# Altium schematic sheet vio-sw.SchDoc: Copper Suicide - Power Switch
size Letter; CheckedBy: E. Chiu; CompanyName: Signal Laboratories, Inc.; DrawnBy: J. Brinton; Engineer: J. Brinton; Address1: 3479 Edison Way; Address2: Menlo Park CA 94025; Address3: +1 (877) 778-8435; Address4: siglabs.com; Revision: 1; SheetNumber: 45; SheetTotal: 47
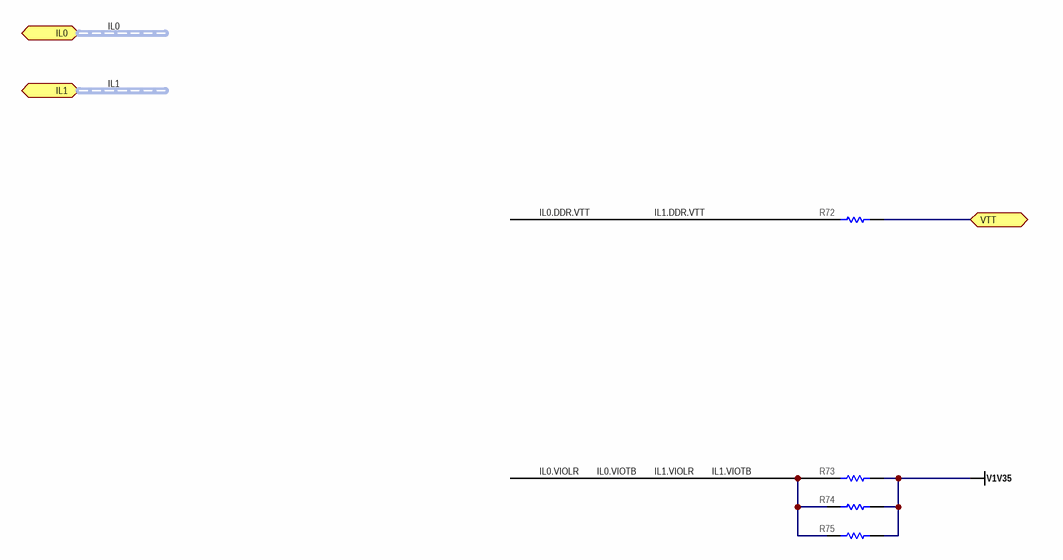
[diagram p0: vio-sw.SchDoc]

## Parts
R72  SOLDER_LINK  [SOLDERLINK0603X26N]  (value not drawn)
R73  SOLDER_LINK  [SOLDERLINK0603X26N]  (value not drawn)
R74  SOLDER_LINK  [SOLDERLINK0603X26N]  (value not drawn)
R75  SOLDER_LINK  [SOLDERLINK0603X26N]  (value not drawn)

## Ports
IL0 (harness IL-1V35), IL1 (harness IL-1V35), VTT

## Nets
V1V35: R73.1 R74.1 R75.1
IL0.DDR.VTT: R72.2  [also labelled IL1.DDR.VTT]
IL0.VIOLR: R73.2 R74.2 R75.2  [also labelled IL0.VIOTB, IL1.VIOLR, IL1.VIOTB]
VTT: R72.1 ; port VTT

## Buses and harness runs
harness IL0 = port IL0
harness IL1 = port IL1

## Notes on the sheet
- Title
- Engineer
- Revision
- Drawn By
- Checked By
- Date
- Sheet
- of

## Library data of the parts
R72-R75 = RES: Solder Link; Manufacturer P/N: *; Manufacturer: *